# Altium schematic sheet Led.SchDoc
size A
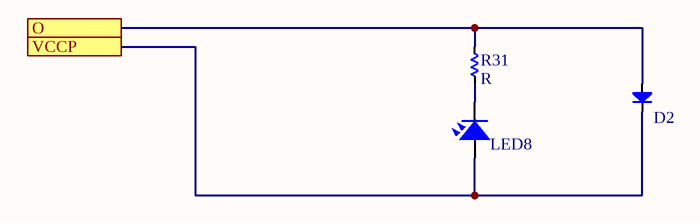
[diagram p0: Led.SchDoc]

## Parts
D2  Diode  [DIO-SMD-123]  (value not drawn)
LED8  LED  [LED-0805-Blue]  (value not drawn)
R31  R  [RES-SMD-0603_BIG]

## Ports
O, VCCP

## Nets
O: D2.1(A) R31.1 ; port O
VCCP: D2.2(K) LED8.1 ; port VCCP
NetLED8_2: LED8.2 R31.2

## Library data of the parts
D2 = Diode: Default Diode; Code - JEDEC: DO-214-AB; Value: 1N5007; Published: 8-Jun-2000; Revision: July-2002: Re-released for DXP Platform.; Publisher: Altium Limited; ComponentLink1Description: ES1J - STMBL; ComponentLink1URL: https://banlinhkien.vn/goods-8089-es1j-do214-diode-1a-600v-sma-es1j-.html
LED8 = LED SMD: Value: LED 3 - 5 ly 2 Colour